# EAGLE design board_shield_esp8266_4relay (EAGLE 9.6.2)
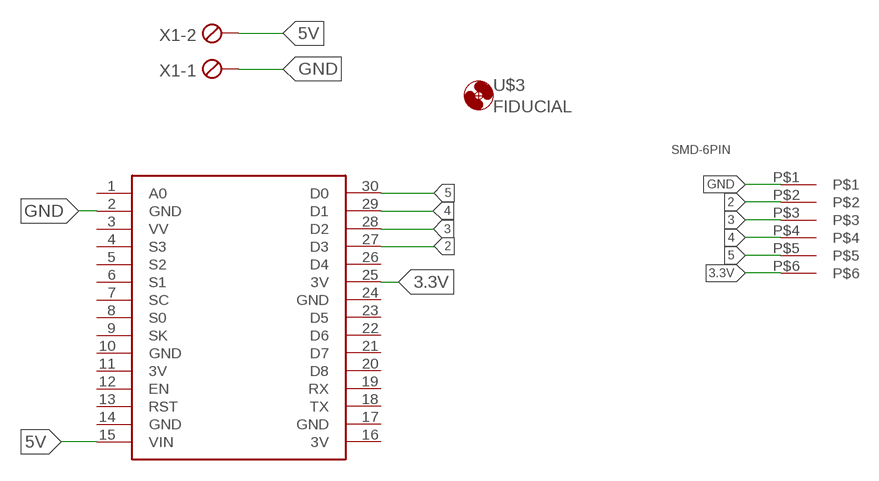
[diagram p0: schematic, sheet 1]

## Parts
U$1  6_PIN_HEADER_SMD_FEMALE  [6_PIN_HEADER_SMD_FEMALE]
U$2  NODEMCU  [NODEMCU]
U$3  FIDUCIAL  [ROLAND_1]
X1  MKDS1/2-3,81  [2POL381]

## Nets
2: U$1.P$2 U$2.27(D3)
3: U$1.P$3 U$2.28(D2)
3.3V: U$1.P$6 U$2.25(3V)
4: U$1.P$4 U$2.29(D1)
5: U$1.P$5 U$2.30(D0)
5V: U$2.15(VIN) X1.2
GND: U$1.P$1 U$2.2(GND) X1.1
Unconnected: U$2.1(A0) U$2.3(VV) U$2.4(S3) U$2.5(S2) U$2.6(S1) U$2.7(SC) U$2.8(S0) U$2.9(SK) U$2.12(EN) U$2.13(RST) U$2.18(TX) U$2.19(RX) U$2.20(D8) U$2.21(D7) U$2.22(D6) U$2.23(D5) U$2.26(D4)

## Notes on the sheet
- SMD-6PIN

## Power pins joined to a net without a drawn wire
3V: U$2.11(3V) U$2.16(3V)
GND: U$2.10(GND) U$2.14(GND) U$2.17(GND) U$2.24(GND)

## Library data of the parts
U$1 = 6_pin_header_smd_female:6_PIN_HEADER_SMD_FEMALE
U$2 = nodemcu:NODEMCU
U$3 = 0 - holes:FIDUCIAL
X1 = 1 - con-phoenix:MKDS1/2-3,81: MKDS 1/2-3,81 - Order No. 1727010 (RS-Online - 101-5384) Pitch: 3,81mm Number of terminals: 2 Rated Voltage: 160V Maximum load current/ cross section: 12A/1.5mm2-AWG16 Housing Interlocking: none Color: Green

## Board
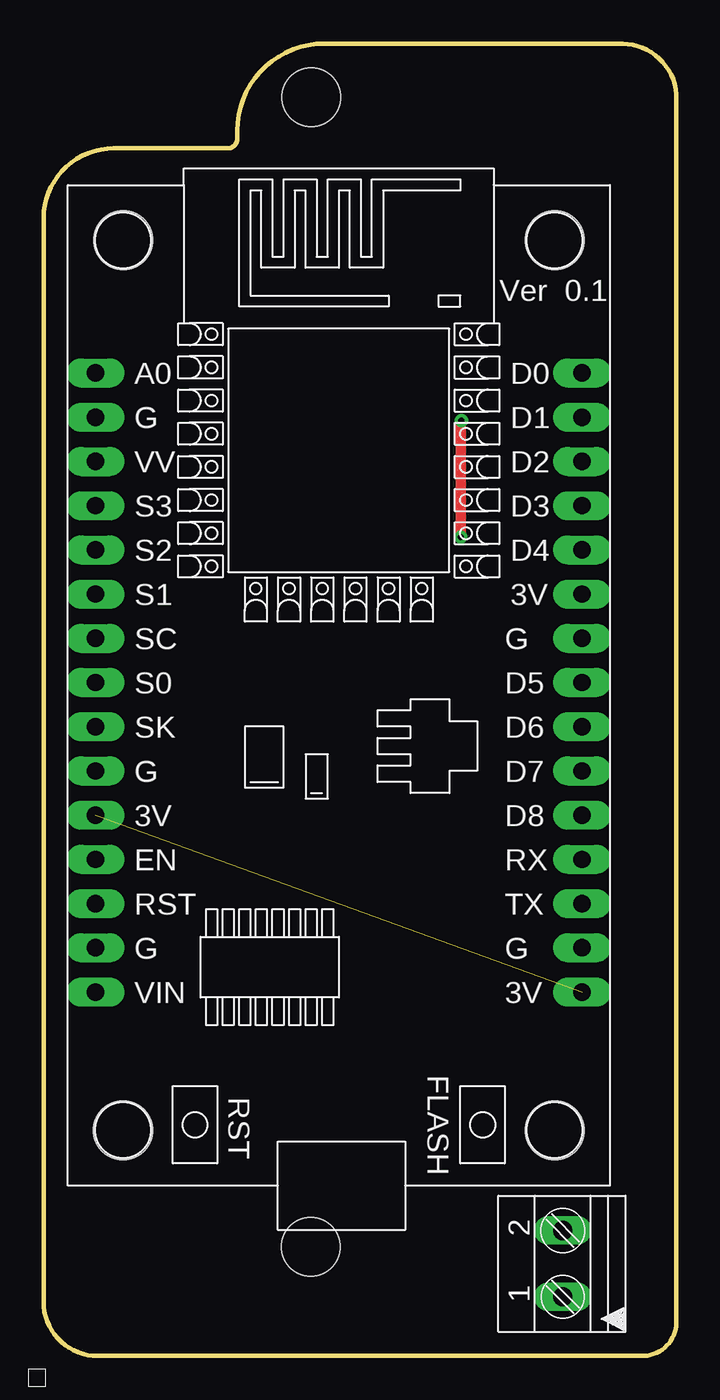
[diagram p1: board, top side]
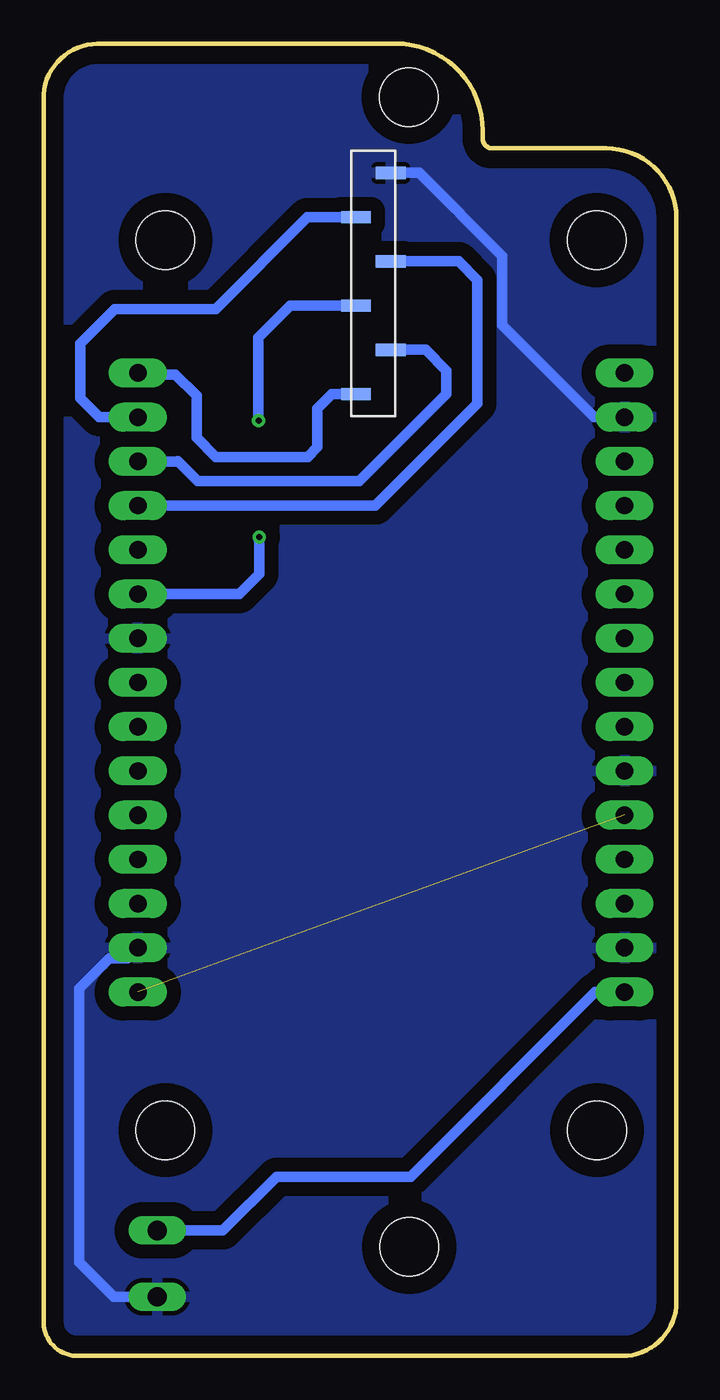
[diagram p2: board, bottom side, seen from below]

Size 36.33 x 75.37 mm. Coordinates in mm from the lower left corner, seen from the top.
Outline: 2.86,0 3.11,0
Outline: 3.11,0 34.33,0 arc90 36.33,1.91 36.33,72.17 arc90 33.25,75.36 30.73,75.36 16.13,75.37 arc90 11.13,70.37 11.13,69.9 arc-90 10.58,69.35 4.01,69.35 arc90 0,65.34 0,3.11 arc90 3.11,0
Copper layers (1*16): Top 0.035mm / dielectric 1.5mm / Bottom 0.035mm
Design rules "default *": minimum track width 6mil, minimum drill 0.35mm, track to track 0.8mm, track to pad 0.8mm, pad to pad 0.8mm, via to via 0.8mm, smd to smd 0.8mm, copper to edge 40mil, drill to drill 6mil, minimum pad ring 10mil, minimum via ring 8mil, stop-mask expansion 4mil, vias tented up to drill 0mil, thermal gap 10mil
Holes 3.35 mm at 4.56,12.97 29.34,12.97 4.58,64.08 29.34,64.08 15.37,72.3 15.34,6.27

### Footprints (pad centres in the part's own frame; a part is rotated, then mirrored left to right if it is on the bottom)
6_PIN_HEADER_SMD_FEMALE = smd 1.7 x 0.7: P$1 1,5.08; P$2 1,0; P$3 1,-5.08; P$4 -1,2.54; P$5 -1,-7.62; P$6 -1,-2.54
NODEMCU = drill 1 pad 1.676 long: 1 -13.97,17.78; 2 -13.97,15.24; 3 -13.97,12.7; 4 -13.97,10.16; 5 -13.97,7.62; 6 -13.97,5.08; 7 -13.97,2.54; 8 -13.97,0; 9 -13.97,-2.54; 10 -13.97,-5.08; 11 -13.97,-7.62; 12 -13.97,-10.16; 13 -13.97,-12.7; 14 -13.97,-15.24; 15 -13.97,-17.78; 16 13.97,-17.78; 17 13.97,-15.24; 18 13.97,-12.7; 19 13.97,-10.16; 20 13.97,-7.62; 21 13.97,-5.08; 22 13.97,-2.54; 23 13.97,0; 24 13.97,2.54; 25 13.97,5.08; 26 13.97,7.62; 27 13.97,10.16; 28 13.97,12.7; 29 13.97,15.24; 30 13.97,17.78
2POL381 = drill 1.1 long: 1 0,0; 2 3.81,0

### Placement (x,y rotation side)
U$1  17.4,62.86 0 bottom
U$2  16.95,38.68 0 top
U$3  -0.88,-1.75 0 top
X1  29.81,3.39 90 top

### Tracks (layer width: path | path; a pad name or v marks a point on that pad's centre or on a via)
2
  Bottom 0.6: U$2.27 17.3,48.84 11.44,54.7 11.44,61.8 12.51,62.87 U$1.P$2
3
  Bottom 0.6: U$1.P$3 14.39,57.79 13.21,56.6 13.21,55.24 18.21,50.24 27.49,50.24 28.64,51.38 U$2.28
3.3V  (via drill 0.35)
  Top 0.6: v23.95,47.03 23.95,53.72 v23.99,53.72
  Bottom 0.6: U$2.25 25.09,43.76 23.95,44.89 23.95,46.79 23.99,46.83 23.99,46.99 v23.95,47.03 | v23.99,53.72 24,53.73 24,58.48 22.16,60.33 U$1.P$6
3V  (1 unrouted)
4
  Bottom 0.6: U$2.29 33.14,53.92 34.24,55.02 34.24,58.14 32.25,60.13 26.45,60.13 21.18,65.41 U$1.P$4
5
  Bottom 0.6: U$2.30 30.83,56.36 28.77,56.36 27.55,55.14 27.55,52.73 26.45,51.64 21.17,51.64 20.61,52.2 20.61,54.42 19.79,55.25 U$1.P$5
5V
  Bottom 0.6: X1.2 26.03,7.2 22.95,10.29 15.27,10.29 4.65,20.9 U$2.15
GND
  Bottom 0.6: U$2.2 4.71,53.92 9.99,59.2 9.99,63.16 14.77,67.95 U$1.P$1 | X1.1 32.31,3.39 34.29,5.37 34.29,21.11 32.56,22.84 31.52,22.84 U$2.17
  pour Bottom: 36.09,0.1 36.09,75.29 0.41,75.29 0.03,74.9 0.28,0.1